# Altium project MFC_rev.2.PrjPcb
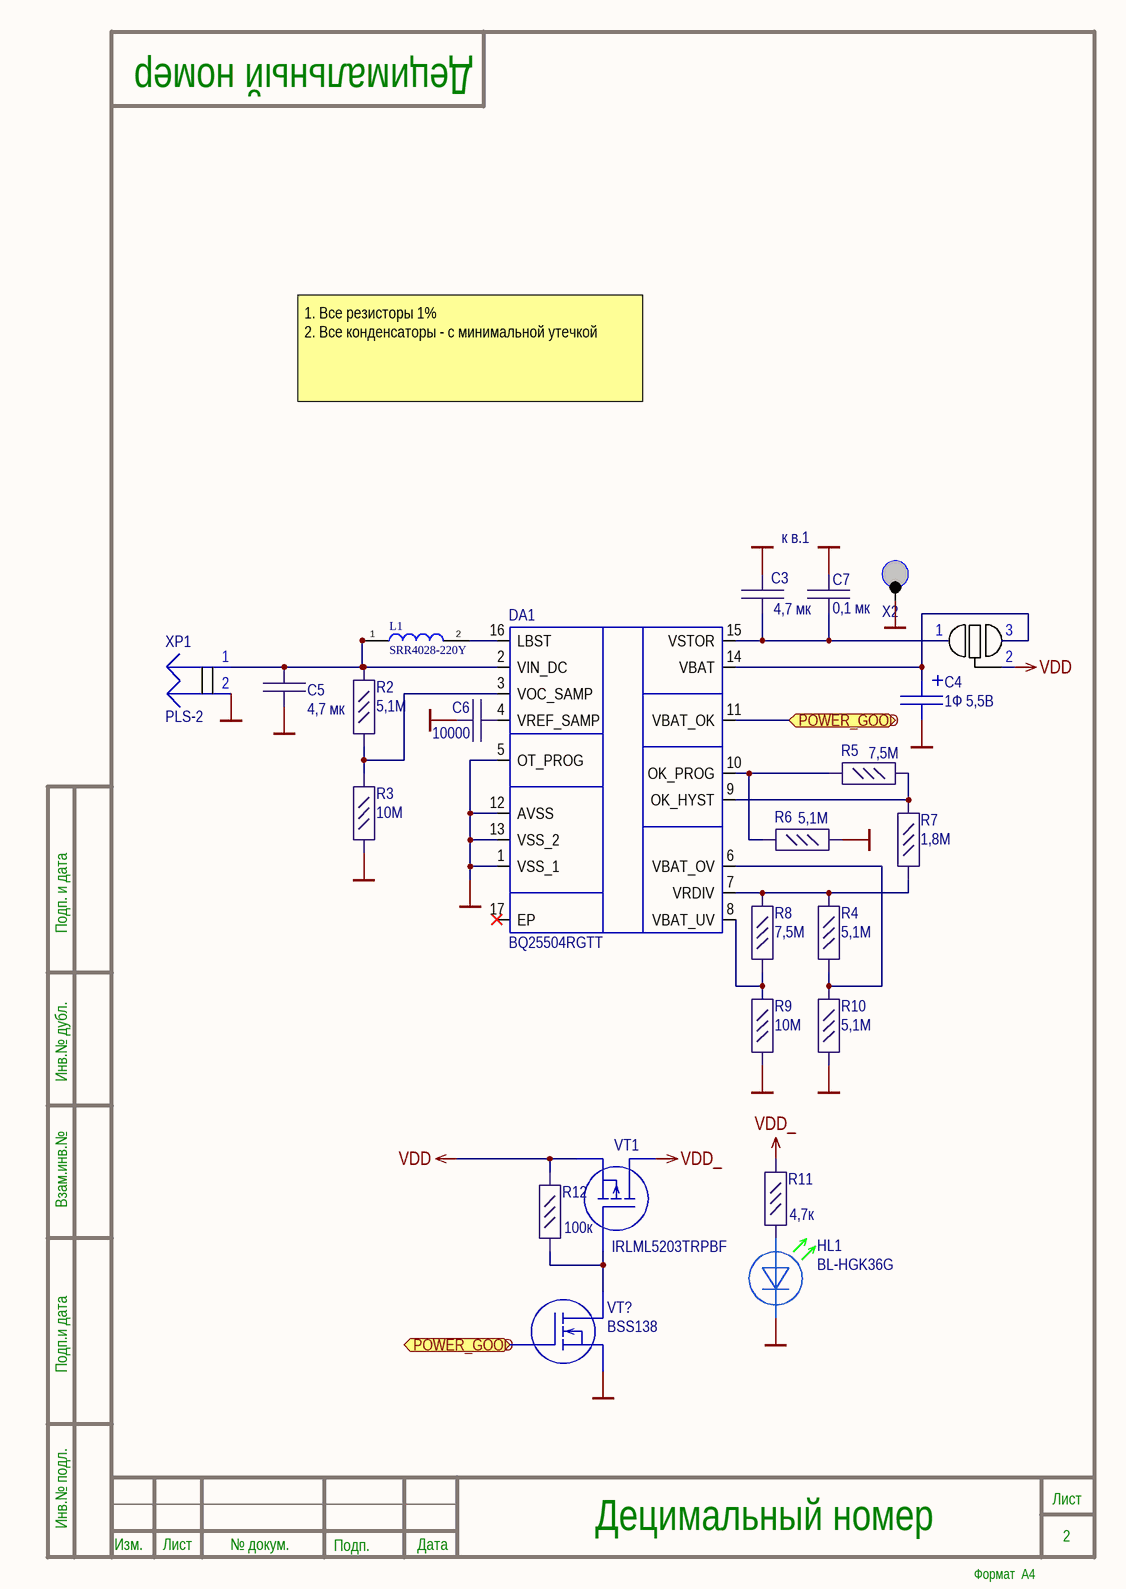
[diagram p0: Power.SchDoc]
4 sheets, 32 parts. Net scope: flat (ports and power ports of the same name join across sheets).
Board file: MFC.PcbDoc
Sheets:
  Power.SchDoc
  MCU.SchDoc
  LoRa.SchDoc
  Sensors.SchDoc

## Sheet Power.SchDoc: Наименование
size 209 x 297 mm; ApprovedBy: Утвердил; CheckedBy: Проверил; Author: Разработал; CompanyName: Организация; DrawnBy: Н.Контр; Engineer: Т.Контр; SheetNumber: 2; SheetTotal: 5; PageSetup: Record=PageOptions|CenterHorizontal=True|CenterVertical=True|PrintScale=0.94|XCorrection=1.00|YCorrection=1.00|PrintKind=1|BorderSize=5000000|LeftOffset=0|BottomOffset=0|Orientation=1|PaperLength=1000|PaperWidth=1000|Scale=100|PaperSource=7|PrintQuality=-4|MediaType=1|DitherType=10|PaperKind=A4|PrintScaleMode=1; DecimalNumber: Децимальный номер; HeadOfSector: Нач. сектора; MainDevice: Перв.примен.; Name: Наименование; DocumentName: Sheet1.SCHDOC

### Parts
C3  4,7 мк  [C_0603]
C4  1Ф 5,5В  [EECF5R5u]
C5  4,7 мк  [C_0603]
C6  10000  [C_0603]
C7  0,1 мк  [C_0603]
DA1  BQ25504RGTT  [VQFN-16]
HL1  BL-HGK36G  [LED_0603_GREEN]
L1  SRR4028-220Y  [SRR4028220Y]
R2  5,1М  [R_0603]
R3  10М  [R_0603]
R4  5,1M  [R_0603]
R5  7,5М  [R_0603]
R6  5,1M  [R_0603]
R7  1,8М  [R_0603]
R8  7,5M  [R_0603]
R9  10M  [R_0603]
R10  5,1M  [R_0603]
R11  4,7к  [R_0603]
R12  100к  [R_0603]
VT1  IRLML5203TRPBF  [SOT23]
VT?  BSS138  [SOT23]
X2  КТ  [KT_2]  (value not drawn)
X4  Solder_jumper_3  [Solder_jumper_3]  (value not drawn)
XP1  PLS-2  [PLS-2]

### Ports
POWER_GOOD (bidir)

### Nets
GND: C3.1 C4.2 C5.1 C6.2 C7.2 DA1.1(VSS_1) DA1.5(OT_PROG) DA1.12(AVSS) DA1.13(VSS_2) HL1.2 R3.1 R6.2 R9.2 R10.2 VT?.2(S) X2.1 XP1.2
VDD: R12.1 VT1.2(S) X4.2
VDD_: R11.1 VT1.3(D)
NetC3_2: C3.2 C7.1 DA1.15(VSTOR) X4.1
NetC4_1: C4.1 DA1.14(VBAT) X4.3
NetC5_2: C5.2 DA1.2(VIN_DC) L1.1 R2.2 XP1.1
NetC6_1: C6.1 DA1.4(VREF_SAMP)
NetDA1_3: DA1.3(VOC_SAMP) R2.1 R3.2
NetDA1_6: DA1.6(VBAT_OV) R4.2 R10.1
NetDA1_7: DA1.7(VRDIV) R4.1 R7.2 R8.1
NetDA1_8: DA1.8(VBAT_UV) R8.2 R9.1
NetDA1_9: DA1.9(OK_HYST) R5.2 R7.1
NetDA1_10: DA1.10(OK_PROG) R5.1 R6.1
NetDA1_11: DA1.11(VBAT_OK) VT?.1(G) ; port POWER_GOOD
NetDA1_16: DA1.16(LBST) L1.2
NetHL1_1: HL1.1 R11.2
NetR12_2: R12.2 VT1.1(G) VT?.3(D)

Not connected (* = marked no-connect by the designer): DA1 17(EP)*

### Notes on the sheet
- 1. Все резисторы 1%
  2. Все конденсаторы - с минимальной утечкой
- к в.1
- Подп. и дата
- Инв.№ дубл.
- Взам.инв.№
- Подп.и дата
- Инв.№ подл.
- Изм.
- Лист
- № докум.
- Подп.
- Дата
- Формат  A4

### Library data of the parts
C3 C5 = GRM185C81A475KE11D: CAP CER 4.7UF 10V X6S 0603; Manufacturer: Murata Electronics; Value: 4.7µF; Part Number: GRM185C81A475KE11D; ComponentLink1URL: https://search.murata.co.jp/Ceramy/image/img/A01X/G101/ENG/GRM185C81A475KE11-01.pdf; ComponentLink1Description: Datasheet; Component Type: Capasitor
C4 = EECF5R5U105: 1 Ф, 5.5 В, 5 мм, 2208H, Ионистор
C6 = GRM1857U1A103JA44D: CAP CER 10000PF 10V U2J 0603; Manufacturer: Murata Electronics; Part Number: GRM1857U1A103JA44D; Value: 10000pF; ComponentLink1URL: https://www.murata.com/~/media/webrenewal/support/library/catalog/products/capacitor/mlcc/c02e.ashx?la=en-us; ComponentLink1Description: Datasheet; Component Type: Capasitor
C7 = GRM188R72A104MA35D: CAP CER 0.1UF 100V X7R 0603; Manufacturer: Murata Electronics; Value: 0.1µF; Part Number: GRM188R72A104MA35D; ComponentLink1URL: https://search.murata.co.jp/Ceramy/image/img/A01X/G101/ENG/GRM188R72A104MA35-01.pdf; ComponentLink1Description: Datasheet; Component Type: Capasitor
DA1 = BQ25504RGTT: Ultra Low-Power Boost Converter With Battery Management For Energy Harvester Applications; Manufacturer_Name: Texas Instruments; Datasheet Link: http://www.ti.com/general/docs/lit/getliterature.tsp?genericPartNumber=BQ25504&&fileType=pdf; Height: 1mm; Manufacturer_Part_Number: BQ25504RGTT; Mouser Part Number: 595-BQ25504RGTT; Mouser Price/Stock: https://www.mouser.co.uk/ProductDetail/Texas-Instruments/BQ25504RGTT?qs=LDM2r2BBpnbezhyy8cKCSA%3D%3D; Arrow Part Number: BQ25504RGTT; Arrow Price/Stock: https://www.arrow.com/en/products/bq25504rgtt/texas-instruments?region=nac
HL1 = BL-HGK36G: SMD LED 0603 TOP зеленый
L1 = SRR4028-220Y: Inductor; Manufacturer_Name: Bourns; Datasheet Link: https://componentsearchengine.com/Datasheets/2/SRR4028-220Y.pdf; Height: 3mm; Manufacturer_Part_Number: SRR4028-220Y; Mouser Part Number: 652-SRR4028-220Y; Mouser Price/Stock: https://www.mouser.co.uk/ProductDetail/Bourns/SRR4028-220Y?qs=s%252BX%2FYkvGCpHgCkRmGbimqg%3D%3D; Arrow Part Number: SRR4028-220Y; Arrow Price/Stock: https://www.arrow.com/en/products/srr4028-220y/bourns
R2 R3 = CR0603-FX-4994ELF: RES SMD 4.99M OHM 1% 1/10W 0603; Manufacturer: Bourns Inc.; Value: 4,99 M; Part Number: CR0603-FX-4994ELF; ComponentLink1URL: https://www.bourns.com/pdfs/chpreztr.pdf; ComponentLink1Description: Datasheet; Component Type: Resistor
R4-R12 = CR0603-FX-3094ELF: RES SMD 3.09M OHM 1% 1/10W 0603; Manufacturer: Bourns Inc.; Value: 3,09 M; Part Number: CR0603-FX-3094ELF; ComponentLink1URL: https://www.bourns.com/pdfs/chpreztr.pdf; ComponentLink1Description: Datasheet; Component Type: Resistor
VT1 = IRLML5203TRPBF: Транзистор, P-канал 30В 3A logic
VT? = BSS138: MOSFET, N-канал, 0.2А, 50В

## Sheet MCU.SchDoc: Наименование
size 209 x 297 mm; ApprovedBy: Утвердил; CheckedBy: Проверил; Author: Разработал; CompanyName: Организация; DrawnBy: Н.Контр; Engineer: Т.Контр; SheetNumber: 3; SheetTotal: 5; PageSetup: Record=PageOptions|CenterHorizontal=True|CenterVertical=True|PrintScale=0.94|XCorrection=1.00|YCorrection=1.00|PrintKind=1|BorderSize=5000000|LeftOffset=0|BottomOffset=0|Orientation=1|PaperLength=1000|PaperWidth=1000|Scale=100|PaperSource=7|PrintQuality=-4|MediaType=1|DitherType=10|PaperKind=A4|PrintScaleMode=1; DecimalNumber: Децимальный номер; HeadOfSector: Нач. сектора; MainDevice: Перв.примен.; Name: Наименование; DocumentName: Sheet1.SCHDOC
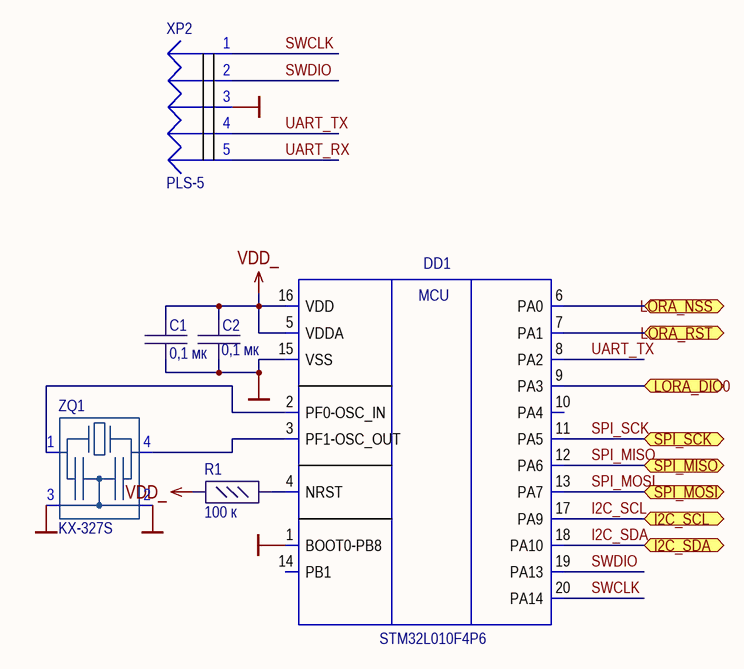
[diagram p1: MCU.SchDoc]

### Parts
C1  0,1 мк  [C_0603]
C2  0,1 мк  [C_0603]
DD1  STM32L010F4P6  [TSSOP-20]
R1  100 к  [R_0603]
XP2  PLS-5  [PLS-5]
ZQ1  KX-327S  [KX-327S]

### Ports
I2C_SCL (bidir), I2C_SDA (bidir), LORA_DIO0 (bidir), LORA_NSS (bidir), LORA_RST (bidir), SPI_MISO (bidir), SPI_MOSI (bidir), SPI_SCK (bidir)

### Nets
GND: C1.1 C2.1 DD1.1(BOOT0-PB8) DD1.15(VSS) XP2.3 ZQ1.2 ZQ1.3
VDD_: C1.2 C2.2 DD1.5(VDDA) DD1.16(VDD) R1.1
I2C_SCL: DD1.17(PA9) ; port I2C_SCL
I2C_SDA: DD1.18(PA10) ; port I2C_SDA
LORA_DIO0: DD1.9(PA3) ; port LORA_DIO0
LORA_NSS: DD1.6(PA0) ; port LORA_NSS
LORA_RST: DD1.7(PA1) ; port LORA_RST
SPI_MISO: DD1.12(PA6) ; port SPI_MISO  [project net LORA_MISO]
SPI_MOSI: DD1.13(PA7) ; port SPI_MOSI  [project net LORA_MOSI]
SPI_SCK: DD1.11(PA5) ; port SPI_SCK  [project net LORA_SCK]
SWCLK: DD1.20(PA14) XP2.1
SWDIO: DD1.19(PA13) XP2.2
UART_RX: XP2.5
UART_TX: DD1.8(PA2) XP2.4
NetDD1_2: DD1.2(PF0-OSC_IN) ZQ1.1
NetDD1_3: DD1.3(PF1-OSC_OUT) ZQ1.4
NetDD1_4: DD1.4(NRST) R1.2

Not connected (* = marked no-connect by the designer): DD1 10(PA4) 14(PB1)

### Notes on the sheet
- Подп. и дата
- Инв.№ дубл.
- Взам.инв.№
- Подп.и дата
- Инв.№ подл.
- Изм.
- Лист
- № докум.
- Подп.
- Дата
- Формат  A4
- (in symbol STM32L010F4P6) MCU

### Library data of the parts
C1 C2 = GRM188R72A104MA35D: as C7 on sheet Power; Part Number: GRM188R72A104MA35D; ComponentLink1URL: https://search.murata.co.jp/Ceramy/image/img/A01X/G101/ENG/GRM188R72A104MA35-01.pdf; ComponentLink1Description: Datasheet; Component Type: Capasitor
R1 = CR0603-FX-1002ELF: RES SMD 10K OHM 1% 1/10W 0603; Manufacturer: Bourns Inc.; Value: 10 к; Part Number: CR0603-FX-1002ELF; ComponentLink1URL: https://www.bourns.com/pdfs/chpreztr.pdf; ComponentLink1Description: Datasheet; Component Type: Resistor
ZQ1 = KX-327S: Кварцевый резонатор 32.768 кГц, 20 ppm

## Sheet LoRa.SchDoc: Наименование
size 209 x 297 mm; ApprovedBy: Утвердил; CheckedBy: Проверил; Author: Разработал; CompanyName: Организация; DrawnBy: Н.Контр; Engineer: Т.Контр; SheetNumber: 4; SheetTotal: 5; PageSetup: Record=PageOptions|CenterHorizontal=True|CenterVertical=True|PrintScale=0.94|XCorrection=1.00|YCorrection=1.00|PrintKind=1|BorderSize=5000000|LeftOffset=0|BottomOffset=0|Orientation=1|PaperLength=1000|PaperWidth=1000|Scale=100|PaperSource=7|PrintQuality=-4|MediaType=1|DitherType=10|PaperKind=A4|PrintScaleMode=1; DecimalNumber: Децимальный номер; HeadOfSector: Нач. сектора; MainDevice: Перв.примен.; Name: Наименование; DocumentName: Sheet1.SCHDOC
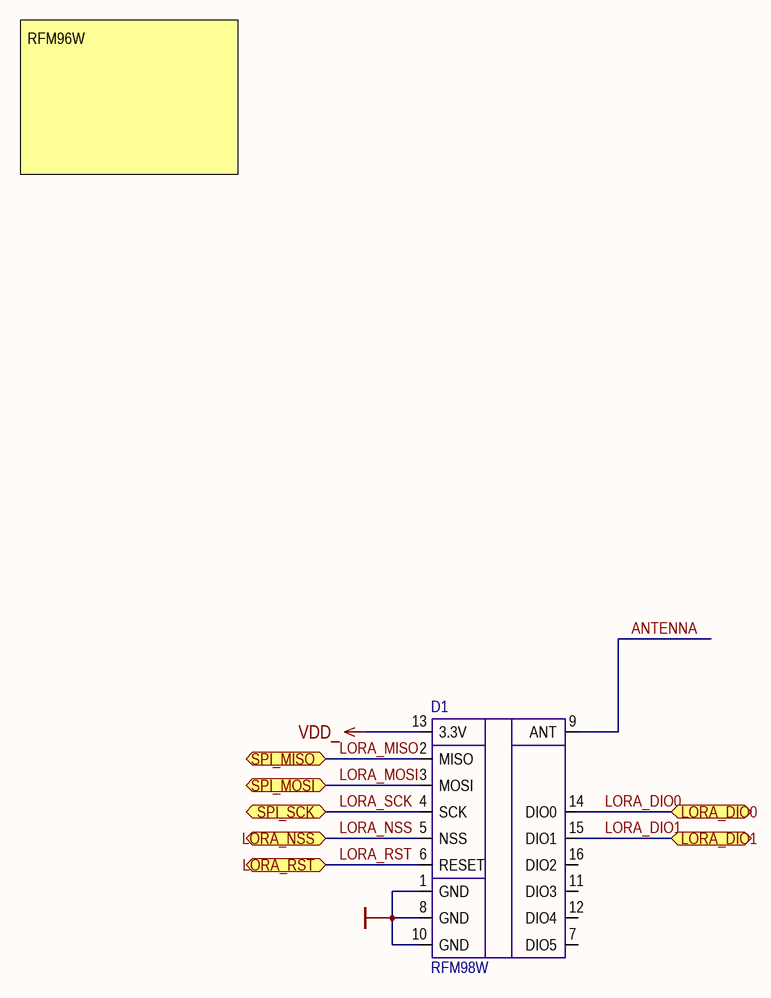
[diagram p2: LoRa.SchDoc]

### Parts
D1  RFM98W  [RFM98W]

### Ports
LORA_DIO0 (bidir), LORA_DIO1 (bidir), LORA_NSS (bidir), LORA_RST (bidir), SPI_MISO (bidir), SPI_MOSI (bidir), SPI_SCK (bidir)

### Nets
GND: D1.1(GND) D1.8(GND) D1.10(GND)
VDD_: D1.13(3.3V)
ANTENNA: D1.9(ANT)
LORA_DIO0: D1.14(DIO0) ; port LORA_DIO0
LORA_DIO1: D1.15(DIO1) ; port LORA_DIO1
LORA_MISO: D1.2(MISO) ; port SPI_MISO
LORA_MOSI: D1.3(MOSI) ; port SPI_MOSI
LORA_NSS: D1.5(NSS) ; port LORA_NSS
LORA_RST: D1.6(RESET) ; port LORA_RST
LORA_SCK: D1.4(SCK) ; port SPI_SCK

Not connected (* = marked no-connect by the designer): D1 7(DIO5) 11(DIO3) 12(DIO4) 16(DIO2)

### Notes on the sheet
- RFM96W
- Подп. и дата
- Инв.№ дубл.
- Взам.инв.№
- Подп.и дата
- Инв.№ подл.
- Изм.
- Лист
- № докум.
- Подп.
- Дата
- Формат  A4

### Library data of the parts
D1 = RFM98W: LoRa modem

## Sheet Sensors.SchDoc: Наименование
size 209 x 297 mm; ApprovedBy: Утвердил; CheckedBy: Проверил; Author: Разработал; CompanyName: Организация; DrawnBy: Н.Контр; Engineer: Т.Контр; SheetNumber: 5; SheetTotal: 5; PageSetup: Record=PageOptions|CenterHorizontal=True|CenterVertical=True|PrintScale=0.94|XCorrection=1.00|YCorrection=1.00|PrintKind=1|BorderSize=5000000|LeftOffset=0|BottomOffset=0|Orientation=1|PaperLength=1000|PaperWidth=1000|Scale=100|PaperSource=7|PrintQuality=-4|MediaType=1|DitherType=10|PaperKind=A4|PrintScaleMode=1; DecimalNumber: Децимальный номер; HeadOfSector: Нач. сектора; MainDevice: Перв.примен.; Name: Наименование; DocumentName: Sheet1.SCHDOC
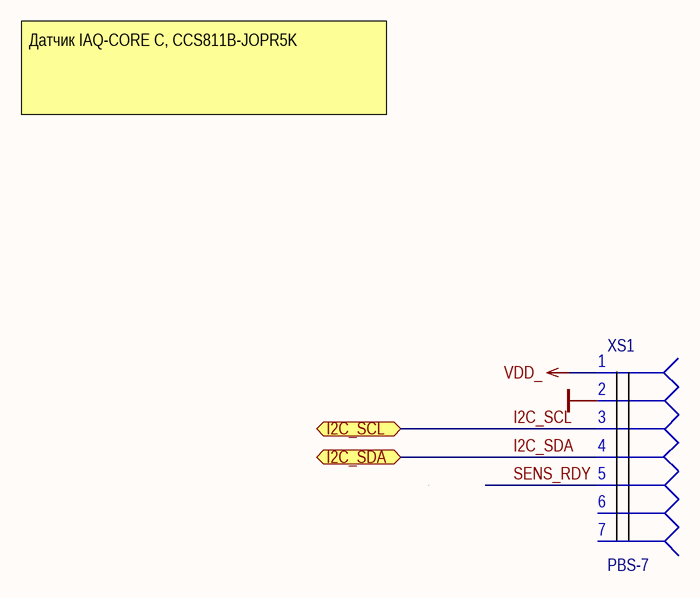
[diagram p3: Sensors.SchDoc]

### Parts
XS1  PBS-7  [PBS-7]

### Ports
I2C_SCL (bidir), I2C_SDA (bidir)

### Nets
GND: XS1.2
VDD_: XS1.1
I2C_SCL: XS1.3 ; port I2C_SCL
I2C_SDA: XS1.4 ; port I2C_SDA
SENS_RDY: XS1.5

Not connected (* = marked no-connect by the designer): XS1 6 7

### Notes on the sheet
- Датчик IAQ-CORE C, CCS811B-JOPR5K
- Подп. и дата
- Инв.№ дубл.
- Взам.инв.№
- Подп.и дата
- Инв.№ подл.
- Изм.
- Лист
- № докум.
- Подп.
- Дата
- Формат  A4

## Nets that join several sheets
GND: Power (17 pins), MCU (7 pins), LoRa (D1.1 D1.8 D1.10), Sensors (XS1.2)
VDD_: Power (R11.1 VT1.3), MCU (5 pins), LoRa (D1.13), Sensors (XS1.1)
I2C_SCL: MCU (DD1.17), Sensors (XS1.3)
I2C_SDA: MCU (DD1.18), Sensors (XS1.4)
LORA_DIO0: MCU (DD1.9), LoRa (D1.14)
LORA_MISO: MCU (DD1.12), LoRa (D1.2)
LORA_MOSI: MCU (DD1.13), LoRa (D1.3)
LORA_NSS: MCU (DD1.6), LoRa (D1.5)
LORA_RST: MCU (DD1.7), LoRa (D1.6)
LORA_SCK: MCU (DD1.11), LoRa (D1.4)